# Altium project Motor_Driver_IR2184_TPH1R403_Board.PrjPcb
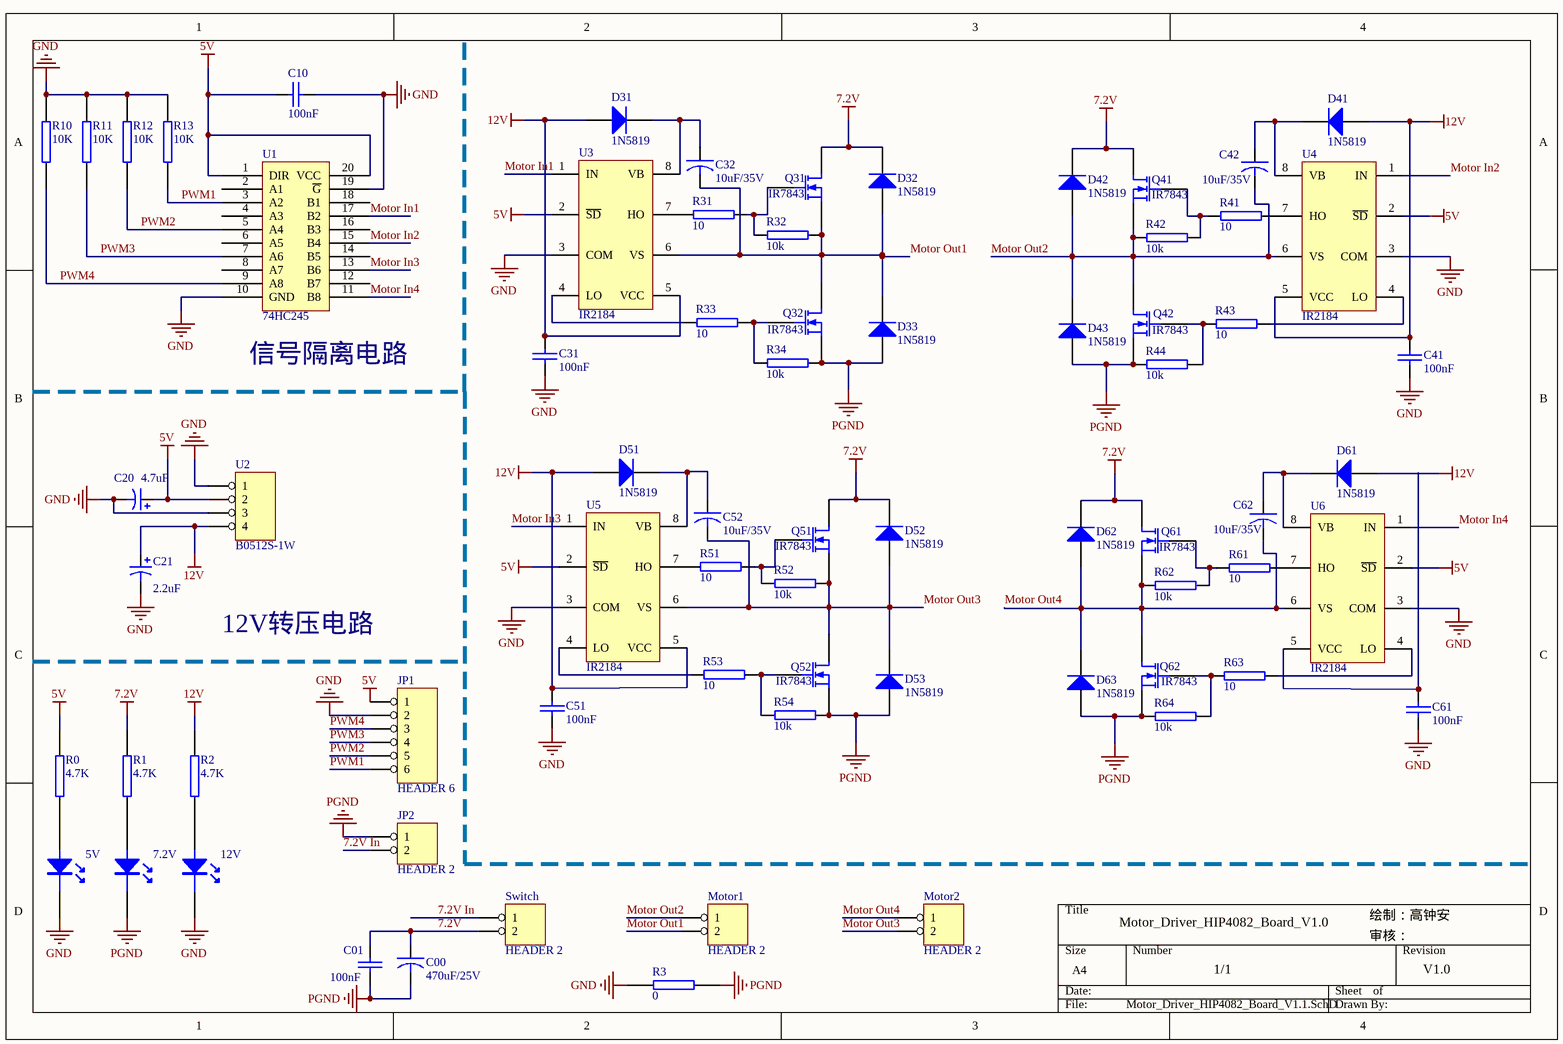
[diagram p0: Motor_Driver_HIP4082_Board_V1.1.SchDoc]
1 sheet, 71 parts. Net scope: global (net labels, ports and power ports of the same name join across sheets).
Board file: Motor_Driver_IR2184_TPH1R403_Board_V1.0.PcbDoc

## Sheet Motor_Driver_HIP4082_Board_V1.1.SchDoc
size A4

### Parts
5V  (no value)  [0805_LED_S1]
7.2V  (no value)  [0805_LED_S1]
12V  (no value)  [0805_LED_S1]
C00  470uF/25V  [RB.2/.4]
C01  100nF  [0805C]
C10  100nF  [0603_C]
C20  value 4.7uF  [3528]
C21  value 2.2uF  [3528]
C31  100nF  [0805C]
C32  10uF/35V  [3528]
C41  100nF  [0805C]
C42  10uF/35V  [3528]
C51  100nF  [0805C]
C52  10uF/35V  [3528]
C61  100nF  [0805C]
C62  10uF/35V  [3528]
D31  1N5819  [3528]
D32  1N5819  [3528]
D33  1N5819  [3528]
D41  1N5819  [3528]
D42  1N5819  [3528]
D43  1N5819  [3528]
D51  1N5819  [3528]
D52  1N5819  [3528]
D53  1N5819  [3528]
D61  1N5819  [3528]
D62  1N5819  [3528]
D63  1N5819  [3528]
JP1  HEADER 6  [SIP6N]
JP2  HEADER 2  [KF301-2P]
Motor1  HEADER 2  [KF301-2P]
Motor2  HEADER 2  [KF301-2P]
Q31  IR7843  [TPH1R403]
Q32  IR7843  [TPH1R403]
Q41  IR7843  [TPH1R403]
Q42  IR7843  [TPH1R403]
Q51  IR7843  [TPH1R403]
Q52  IR7843  [TPH1R403]
Q61  IR7843  [TPH1R403]
Q62  IR7843  [TPH1R403]
R0  4.7K  [0603_R]
R1  4.7K  [0603_R]
R2  4.7K  [0603_R]
R3  0  [0805]
R10  10K  [0603_R]
R11  10K  [0603_R]
R12  10K  [0603_R]
R13  10K  [0603_R]
R31  10  [0805]
R32  10k  [0805]
R33  10  [0805]
R34  10k  [0805]
R41  10  [0805]
R42  10k  [0805]
R43  10  [0805]
R44  10k  [0805]
R51  10  [0805]
R52  10k  [0805]
R53  10  [0805]
R54  10k  [0805]
R61  10  [0805]
R62  10k  [0805]
R63  10  [0805]
R64  10k  [0805]
Switch  HEADER 2  [SWITCH-MINI]
U1  74HC245  [SOP20]
U2  B0512S-1W  [SIP4_B_S-1W]
U3  IR2184  [SO-8]
U4  IR2184  [SO-8]
U5  IR2184  [SO-8]
U6  IR2184  [SO-8]

### Nets
5V: C10.1 C20.1 JP1.1 R0.2 U1.1(DIR) U1.20(VCC) U2.2 U3.2(~{SD}) U4.2(~{SD}) U5.2(~{SD}) U6.2(~{SD})
7.2V: C00.1 C01.2 D32.2(K) D42.2(K) D52.2(K) D62.2(K) Q31.1(D) Q41.1(D) Q51.1(D) Q61.1(D) R1.2 Switch.2
12V: C21.1 C31.1 C41.1 C51.1 D31.1(A) D41.1(A) D51.1(A) D61.1(A) R2.2 U2.4 U3.5(VCC) U4.5(VCC) U5.5(VCC)
GND: 5V.K 12V.K C10.2 C20.2 C21.2 C31.2 C41.2 C51.2 C61.2 JP1.2 R3.2 R10.2 R11.1 R12.2 R13.2 U1.10(GND) U1.19(~{G}) U2.1 U2.3 U3.3(COM) U4.3(COM) U5.3(COM) U6.3(COM)
PGND: 7.2V.K C00.2 C01.1 D33.1(A) D43.1(A) D53.1(A) D63.1(A) JP2.1 Q32.3(S) Q42.3(S) Q52.3(S) Q62.3(S) R3.1 R34.1 R44.2 R54.1 R64.2
7.2V In: JP2.2 Switch.1
Motor In1: U1.17(B2) U3.1(IN)
Motor In2: U1.15(B4) U4.1(IN)
Motor In3: U1.13(B6) U5.1(IN)
Motor In4: U1.11(B8) U6.1(IN)
Motor Out1: C32.2 D32.1(A) D33.2(K) Motor1.2 Q31.3(S) Q32.1(D) R32.1 U3.6(VS)
Motor Out2: C42.2 D42.1(A) D43.2(K) Motor1.1 Q41.3(S) Q42.1(D) R42.2 U4.6(VS)
Motor Out3: C52.2 D52.1(A) D53.2(K) Motor2.2 Q51.3(S) Q52.1(D) R52.1 U5.6(VS)
Motor Out4: C62.2 D62.1(A) D63.2(K) Motor2.1 Q61.3(S) Q62.1(D) R62.2 U6.6(VS)
PWM1: JP1.6 R13.1 U1.3(A2)
PWM2: JP1.5 R12.1 U1.5(A4)
PWM3: JP1.4 R11.2 U1.7(A6)
PWM4: JP1.3 R10.1 U1.9(A8)
Net5V_A: 5V.A R0.1
Net7.2V_A: 7.2V.A R1.1
Net12V_A: 12V.A R2.1
NetC32_1: C32.1 D31.2(K) U3.8(VB)
NetC42_1: C42.1 D41.2(K) U4.8(VB)
NetC52_1: C52.1 D51.2(K) U5.8(VB)
NetC61_1: C61.1 U6.5(VCC)
NetC62_1: C62.1 D61.2(K) U6.8(VB)
NetQ31_2: Q31.2(G) R31.2 R32.2
NetQ32_2: Q32.2(G) R33.2 R34.2
NetQ41_2: Q41.2(G) R41.2 R42.1
NetQ42_2: Q42.2(G) R43.2 R44.1
NetQ51_2: Q51.2(G) R51.2 R52.2
NetQ52_2: Q52.2(G) R53.2 R54.2
NetQ61_2: Q61.2(G) R61.2 R62.1
NetQ62_2: Q62.2(G) R63.2 R64.1
NetR31_1: R31.1 U3.7(HO)
NetR33_1: R33.1 U3.4(LO)
NetR41_1: R41.1 U4.7(HO)
NetR43_1: R43.1 U4.4(LO)
NetR51_1: R51.1 U5.7(HO)
NetR53_1: R53.1 U5.4(LO)
NetR61_1: R61.1 U6.7(HO)
NetR63_1: R63.1 U6.4(LO)

Not connected (* = marked no-connect by the designer): U1 2(A1) 4(A3) 6(A5) 8(A7) 12(B7) 14(B5) 16(B3) 18(B1)

### Notes on the sheet
- (near U1) 信号隔离电路
- 12V转压电路
- Motor_Driver_HIP4082_Board_V1.0
- 绘制：高钟安
- 1/1
- 审核：
- V1.0

### Library data of the parts
5V 7.2V 12V = LED
C00 C32 C42 C52 C62 = CAPACITOR
C01 C10 C31 C41 C51 C61 = CAP: Capacitor
C20 C21 = Cap Pol3: Polarized Capacitor (Surface Mount); Published: 8-Jun-2000; LatestRevisionDate: 29-May-2009; LatestRevisionNote: IPC-7351 Footprint Added.; PackageReference: C0805; Publisher: Altium Limited; PackageDescription: Chip Capacitor
D31-D33 D41-D43 D51-D53 D61-D63 = Diode: Default Diode; Published: 8-Jun-2000; LatestRevisionDate: 17-Jul-2002; LatestRevisionNote: Re-released for DXP Platform.; PackageVersion: Sep-1996; PackageReference: SMC; Publisher: Altium Limited; PackageDescription: DO-214-AB/SMC; 2 C-Bend Leads; Body 7.9 x 5.9 mm, inc. leads (LxW); Code_JEDEC: DO-214-AB
Q31 Q32 Q41 Q42 Q51 Q52 Q61 Q62 = MOSFET-N: N-Channel MOSFET; Published: 8-Jun-2000; LatestRevisionDate: 17-Jul-2002; LatestRevisionNote: Re-released for DXP Platform.; PackageVersion: 1995/1996; PackageReference: E3; Publisher: Altium Limited; PackageDescription: TO, Flat Index; 3 In-Line, Axial Leads; Body Dia. 4.6mm; Lead Dia. 0.5 mm (max)
R0-R3 R10-R13 = RES2
R31-R34 R41-R44 R51-R54 R61-R64 = RES2_1
U2 = 4 HEADER: 4 Pin Header